# EAGLE design Mirtle_H-Bridge_shield_unoR2_DRV8833_dc90_rev1e (EAGLE 6.6.0)
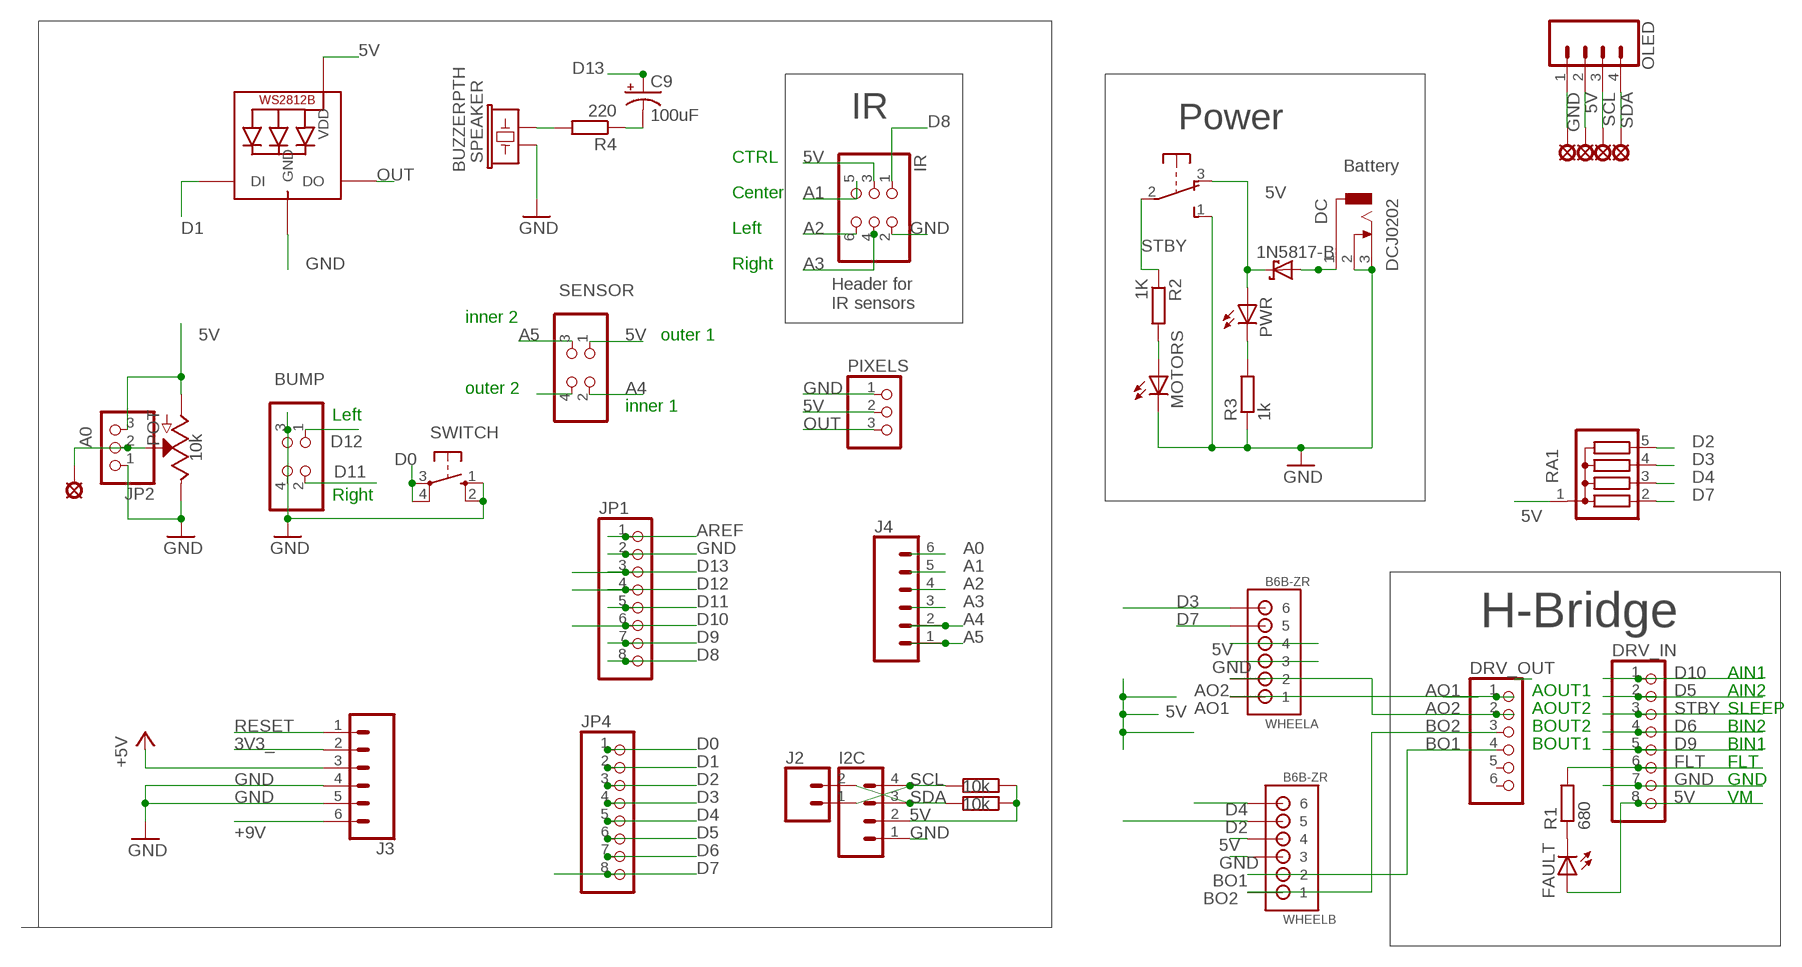
[diagram p0: schematic, sheet 1]

## Parts
BUMP  PINHD-2X2  [2X02]
C9  100uF  CPOL-USE2.5-5  [E2,5-5]
D1  1N5817-B  [DO41-7.6]
DC  DCJ0202  [DCJ0202]
DRV_IN  HEADER-1X870MIL  [1X08_ROUND_70]
DRV_OUT  PINHD-1X6CLEAN  [1X06-CLEAN]
FAULT  LED3MM  [LED3MM]
I2C  CONN_04  [1X04]
IR  PINHD-2X3  [2X03]
J2  CONN_02  [1X02]
J3  CONN_06NO_SILK_FEMALE_PTH  [1X06_NO_SILK]
J4  CONN_06NO_SILK_FEMALE_PTH  [1X06_NO_SILK]
JP1  PINHD-1X8CLEANBIG  [1X08-CLEANBIG]
JP2  PINHD-1X3CB  [1X03-CLEANBIG]
JP4  PINHD-1X8CLEANBIG  [1X08-CLEANBIG]
LED1  WS2812B5050  [WS2812B]
LSP1  LSP10  [LSP10]
LSP13  LSP10  [LSP10]
LSP14  LSP10  [LSP10]
LSP15  LSP10  [LSP10]
LSP16  LSP10  [LSP10]
MOTORS  LED3MM  [LED3MM]
OLED  CONN_04  [1X04]
PIXELS  PINHD-1X3  [1X03]
POT  10k  POTENTIOMETER-PTH-9MM-1/20W-20%  [POT-PTH-ALPS]
PWR  LED3MM  [LED3MM]
R1  680  R-EU_0204/5  [0204/5]
R2  1K  R-EU_0204/5  [0204/5]
R3  1k  R-EU_0204/5  [0204/5]
R4  220  R-EU_0204/5  [0204/5]
R5  10k  R-EU_0204/5  [0204/5]
R6  10k  R-EU_0204/5  [0204/5]
RA1  G04R  [SIL5]
SENSOR  PINHD-2X2  [2X02]
SPEAKER  BUZZERPTH  [BUZZER-12MM]
SW1  OS102011MA1Q  [OS102011MA1Q]
SWITCH  10-XX  [B3F-10XX]
WHEELA  B6B-ZR  [B6B-ZR]
WHEELB  B6B-ZR  [B6B-ZR]

## Nets
3V3_: J3.2
5V: D1.C DRV_IN.8 FAULT.A I2C.2 IR.3 J3.3 JP2.3 LED1.1-VDD(VDD) LSP14.MP OLED.2 PIXELS.2 POT.P$3(A) PWR.A R5.1 R6.1 RA1.1 SENSOR.1 SW1.3(O) WHEELA.4 WHEELB.4 ; supply symbol labelled +5V
5VIN: D1.A DC.1
+9V: J3.6
A0: J4.6 JP2.2 LSP1.MP POT.P$2(S)
A1: IR.5 J4.5
A2: IR.6 J4.4
A3: IR.4 J4.3
A4: J4.2 SENSOR.2
A5: J4.1 SENSOR.3
AO1: DRV_OUT.1 WHEELA.1
AO2: DRV_OUT.2 WHEELA.2
AREF: JP1.1
BO1: DRV_OUT.4 WHEELB.2
BO2: DRV_OUT.3 WHEELB.1
D0: JP4.1 SWITCH.3(P) SWITCH.4(P1)
D1: JP4.2 LED1.4-DIN(DI)
D2: JP4.3 RA1.5 WHEELB.5
D3: JP4.4 RA1.4 WHEELA.6
D4: JP4.5 RA1.3 WHEELB.6
D5: DRV_IN.2 JP4.6
D6: DRV_IN.4 JP4.7
D7: JP4.8 RA1.2 WHEELA.5
D8: IR.1 JP1.8
D9: DRV_IN.5 JP1.7
D10: DRV_IN.1 JP1.6
D11: BUMP.2 JP1.5
D12: BUMP.1 JP1.4
D13: C9.+ JP1.3
FLT: DRV_IN.6 R1.2
GND: BUMP.3 BUMP.4 DC.2 DC.3 DRV_IN.7 I2C.1 IR.2 J3.4 J3.5 JP1.2 JP2.1 LED1.3-GND(GND) LSP13.MP MOTORS.K(C) OLED.1 PIXELS.1 POT.P$1(E) R3.1 SENSOR.4 SPEAKER.+ SW1.1(S) SWITCH.1(S) SWITCH.2(S1) WHEELA.3 WHEELB.3
N$5: PWR.K(C) R3.2
N$7: R4.2 SPEAKER.-
N$8: C9.- R4.1
N$10: FAULT.K(C) R1.1
N$16: MOTORS.A R2.2
OUT: LED1.2-DOUT(DO) PIXELS.3
RESET: J3.1
SCL: I2C.4 J2.1 LSP15.MP OLED.3 R5.2
SDA: I2C.3 J2.2 LSP16.MP OLED.4 R6.2
STBY: DRV_IN.3 R2.1 SW1.2(P)
Unconnected: DRV_OUT.5 DRV_OUT.6 SW1.MT1(MT) SW1.MT2(MT)

## Notes on the sheet
- IR | Power
- CTRL
- Battery
- Center
- Left
- Right
- Header for
  IR sensors
- inner 2
- outer 1
- outer 2
- inner 1
- Left
- Right
- H-Bridge
- AIN1
- AOUT1 | AIN2
- AOUT2 | SLEEP
- BOUT2 | BIN2
- BOUT1 | BIN1
- FLT
- GND
- VM

## Library data of the parts
BUMP SENSOR = pinhead:PINHD-2X2: PIN HEADER
C9 = adafruit:CPOL-US: POLARIZED CAPACITOR, American symbol
D1 = diode:1N581*: 1.0A SCHOTTKY BARRIER RECTIFIER Source: http://www.diodes.com/datasheets/ds23001.pdf
DC = con-jack:DCJ0202: DC POWER JACK Source: DCJ0202.pdf; OC_FARNELL: unknown; OC_NEWARK: unknown
DRV_IN = microbuilder:HEADER-1X8: PIN HEADER
DRV_OUT = adafruit:PINHD-1X6: PIN HEADER
FAULT MOTORS PWR = led:LED: LED OSRAM: - CHIPLED LG R971, LG N971, LY N971, LG Q971, LY Q971, LO R971, LY R971 LH N974, LH R974 LS Q976, LO Q976, LY Q976 LO Q996 - Hyper CHIPLED LW Q18S LB Q993, LB Q99A, LB R99A - SideLED LS A670, LO A670, LY A670, LG A670, LP A670 LB A673, LV A673, LT A673, LW A673 LH A674 LY A675 LS A676, LA A676, LO A676, LY A676, LW A676 LS A679, LY A679, LG A679 - Hyper Micro SIDELED® LS Y876, LA Y876, LO Y876, LY Y876 LT Y87S - SmartLED LW L88C, LW L88S LB L89C, LB L89S, LG L890 LS L89K, LO L89K, LY L89K LS L896, LA L896, LO L896, LY L896 - TOPLED LS T670, LO T670, LY T670, LG T670, LP T670 LSG T670, LSP T670, LSY T670, LOP T670, LYG T670 LG T671, LOG T671, LSG T671 LB T673, LV T673, LT T673, LW T673 LH T674 LS T676, LA T676, LO T676, LY T676, LB T676, LH T676, LSB T676, LW T676 LB T67C, LV T67C, LT T67C, LS T67K, LO T67K, LY T67K, LW E67C LS E67B, LA E67B, LO E67B, LY E67B, LB E67C, LV E67C, LT E67C LW T67C LS T679, LY T679, LG T679 LS T770, LO T770, LY T770, LG T770, LP T770 LB T773, LV T773, LT T773, LW T773 LH T774 LS E675, LA E675, LY E675, LS T675 LS T776, LA T776, LO T776, LY T776, LB T776 LHGB T686 LT T68C, LB T68C - Hyper Mini TOPLED® LB M676 - Mini TOPLED Santana® LG M470 LS M47K, LO M47K, LY M47K Source: http://www.osram.convergy.de LUXEON: - LUMILED® LXK2-PW12-R00, LXK2-PW12-S00, LXK2-PW14-U00, LXK2-PW14-V00 LXK2-PM12-R00, LXK2-PM12-S00, LXK2-PM14-U00 LXK2-PE12-Q00, LXK2-PE12-R00, LXK2-PE12-S00, LXK2-PE14-T00, LXK2-PE14-U00 LXK2-PB12-K00, LXK2-PB12-L00, LXK2-PB12-M00, LXK2-PB14-N00, LXK2-PB14-P00, LXK2-PB14-Q00 LXK2-PR12-L00, LXK2-PR12-M00, LXK2-PR14-Q00, LXK2-PR14-R00 LXK2-PD12-Q00, LXK2-PD12-R00, LXK2-PD12-S00 LXK2-PH12-R00, LXK2-PH12-S00 LXK2-PL12-P00, LXK2-PL12-Q00, LXK2-PL12-R00 Source: www.luxeon.com KINGBRIGHT: KA-3528ASYC Source: www.kingbright.com
I2C OLED = SparkFun-Connectors:CONN_04: Multi connection point. Often used as Generic Header-pin footprint for 0.1 inch spaced/style header connections On any of the 0.1 inch spaced packages, you can populate with these: Break Away Headers - Straight <https://www.sparkfun.com/products/116> (PRT-00116) Break Away Male Headers - Right Angle <https://www.sparkfun.com/products/553> (PRT-00553) Female Headers <https://www.sparkfun.com/products/115> (PRT-00115) Break Away Headers - Machine Pin <https://www.sparkfun.com/products/117> (PRT-00117) Break Away Female Headers - Swiss Machine Pin <https://www.sparkfun.com/products/743> (PRT-00743) For SCREWTERMINALS and SPRING TERMINALS visit here: Screw Terimnals on SparkFun.com <https://www.sparkfun.com/search/results?term=Screw+Terminals> (5mm/3.5mm/2.54mm spacing) This device is also useful as a general connection point to wire up your design to another part of your project. Our various solder wires solder well into these plated through hole pads. Hook-Up Wire - Assortment (Stranded, 22 AWG) <https://www.sparkfun.com/products/11375> (PRT-11375) Hook-Up Wire - Assortment (Solid Core, 22 AWG) <https://www.sparkfun.com/products/11367> (PRT-11367) View the entire wire category on our website here <https://www.sparkfun.com/categories/141> Special notes: Molex polarized connector foot print use with SKU : PRT-08231 with associated crimp pins and housings. 1MM SMD Version SKU: PRT-10208; PROD_ID: CONN-09696
IR = pinhead:PINHD-2X3: PIN HEADER
J2 = SparkFun-Connectors:CONN_02: Multi connection point. Often used as Generic Header-pin footprint for 0.1 inch spaced/style header connections On any of the 0.1 inch spaced packages, you can populate with these: Break Away Headers - Straight <https://www.sparkfun.com/products/116> (PRT-00116) Break Away Male Headers - Right Angle <https://www.sparkfun.com/products/553> (PRT-00553) Female Headers <https://www.sparkfun.com/products/115> (PRT-00115) Break Away Headers - Machine Pin <https://www.sparkfun.com/products/117> (PRT-00117) Break Away Female Headers - Swiss Machine Pin <https://www.sparkfun.com/products/743> (PRT-00743) For SCREWTERMINALS and SPRING TERMINALS visit here: Screw Terimnals on SparkFun.com <https://www.sparkfun.com/search/results?term=Screw+Terminals> (5mm/3.5mm/2.54mm spacing) This device is also useful as a general connection point to wire up your design to another part of your project. Our various solder wires solder well into these plated through hole pads. Hook-Up Wire - Assortment (Stranded, 22 AWG) <https://www.sparkfun.com/products/11375> (PRT-11375) Hook-Up Wire - Assortment (Solid Core, 22 AWG) <https://www.sparkfun.com/products/11367> (PRT-11367) View the entire wire category on our website here <https://www.sparkfun.com/categories/141> Special notes: Molex polarized connector foot print use with: PRT-08233 with associated crimp pins and housings. 2.54_SCREWTERM for use with PRT-10571. 3.5mm Screw Terminal footprints for PRT-08084 5mm Screw Terminal footprints for use with PRT-08432
J3 J4 = SparkFun-Connectors:CONN_06: Multi connection point. Often used as Generic Header-pin footprint for 0.1 inch spaced/style header connections On any of the 0.1 inch spaced packages, you can populate with these: Break Away Headers - Straight <https://www.sparkfun.com/products/116> (PRT-00116) Break Away Male Headers - Right Angle <https://www.sparkfun.com/products/553> (PRT-00553) Female Headers <https://www.sparkfun.com/products/115> (PRT-00115) Break Away Headers - Machine Pin <https://www.sparkfun.com/products/117> (PRT-00117) Break Away Female Headers - Swiss Machine Pin <https://www.sparkfun.com/products/743> (PRT-00743) Arduino Stackable Header - 6 Pin <https://www.sparkfun.com/products/9280> (PRT-09280) For SCREWTERMINALS and SPRING TERMINALS visit here: Screw Terimnals on SparkFun.com <https://www.sparkfun.com/search/results?term=Screw+Terminals> (5mm/3.5mm/2.54mm spacing) This device is also useful as a general connection point to wire up your design to another part of your project. Our various solder wires solder well into these plated through hole pads. Hook-Up Wire - Assortment (Stranded, 22 AWG) <https://www.sparkfun.com/products/11375> (PRT-11375) Hook-Up Wire - Assortment (Solid Core, 22 AWG) <https://www.sparkfun.com/products/11367> (PRT-11367) View the entire wire category on our website here <https://www.sparkfun.com/categories/141>; PROD_ID: CONN-08437
JP1 JP4 = adafruit:PINHD-1X8: PIN HEADER
JP2 = adafruit_mem:PINHD-1X3: PIN HEADER
LED1 = adafruitx:WS2812B
LSP1 LSP13-LSP16 = solpad:LSP10: SOLDER PAD drill 1.0 mm, distributor Buerklin, 12H555
PIXELS = adafruit:PINHD-1X3: PIN HEADER
POT = SparkFun-Resistors:POTENTIOMETER: Potentiometer (Pot) Three-terminal potentiometers, with an adjustable wiper and two adjustable resistors. A pot can be used to create a configurable voltage divider, or as a variable resistor. Variants ALPS_POT and ALPS_POT_KIT - PTH, breadboard compatible, 9mm square pots Rotary Potentiometer - Linear (10k ohm) <https://www.sparkfun.com/products/9288> (COM-09288) The KIT variant exposes copper on only one side of the PTH pad, so the part can only be assembled on one side of the PCB. Useful for beginner soldering kits.; PROD_ID: RES-09177; SF_SKU: COM-09288
R1-R6 = resistor:R-EU_: RESISTOR, European symbol
RA1 = resistor-sil:G04R: SIL RESISTOR; OC_FARNELL: unknown; OC_NEWARK: unknown
SPEAKER = SparkFun-Electromechanical:BUZZER: Buzzer 12mm Spark Fun Electronics SKU : Comp-Buzzer
SW1 = adafruit_mem:OS102011MA1Q: OS10201MA1Q through-hole right angle switch http://www.ladyada.net/library/eagle
SWITCH = switch-omron:10-XX: OMRON SWITCH; MPN: B3F-1000; OC_FARNELL: 176432; OC_NEWARK: 36M3542
WHEELA WHEELB = jst:B6B-ZR: JST-ZH Connector 6 pol, 1.5mm pitch Package: B6B-ZR Source: http://www.jst-mfg.com/product/pdf/eng/eZH.pdf

## Board
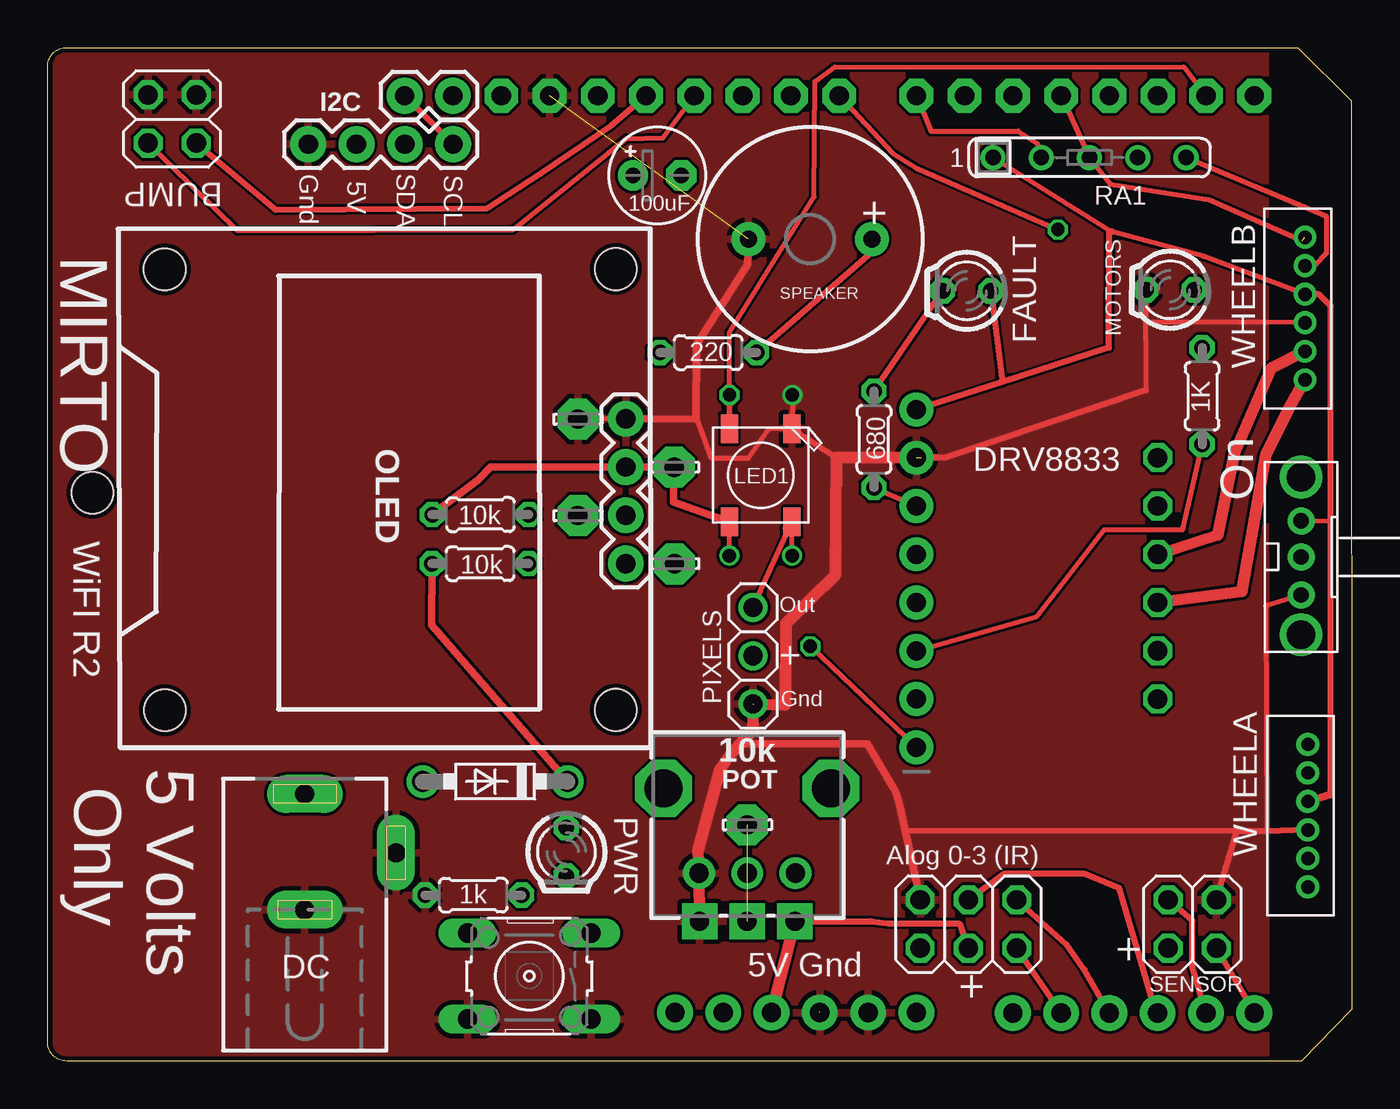
[diagram p1: board, top side]
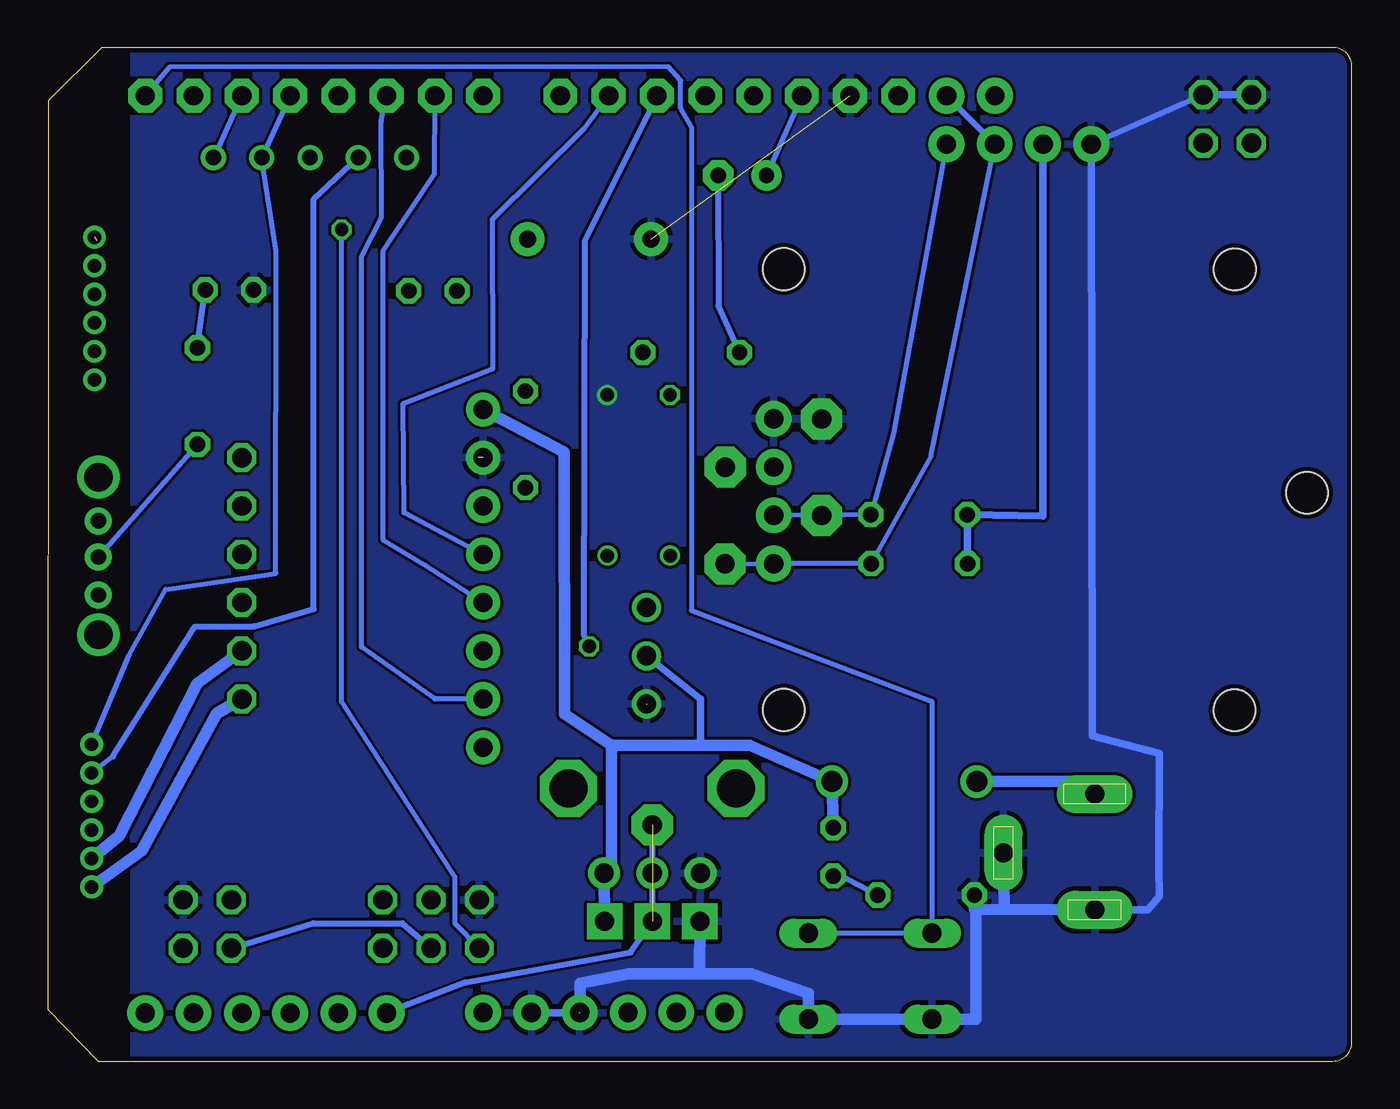
[diagram p2: board, bottom side, seen from below]

Size 68.64 x 53.34 mm. Coordinates in mm from the lower left corner, seen from the top.
Outline: 65.79,53.34 68.61,50.55 68.64,2.73 65.98,0 1,0 arc-90 0,1 0,52.34 arc-90 1,53.34 65.79,53.34
Copper layers (1*16): Top 0.035mm / dielectric 1.5mm / Bottom 0.035mm
Design rules "SeeedStudio_2layer_DRU_no_angle_20140221": minimum track width 6mil, minimum drill 12mil, track to track 6mil, track to pad 6mil, pad to pad 6mil, via to via 6mil, smd to smd 0mil, copper to edge 10mil, drill to drill 10mil, minimum pad ring 10mil, minimum via ring 6mil, stop-mask expansion 2mil, vias tented up to drill 100mil, thermal gap 10mil
Holes 2.2 mm at 6.17,41.67 6.18,18.47 29.9,41.68 29.9,18.48 2.37,29.9

### Footprints (pad centres in the part's own frame; a part is rotated, then mirrored left to right if it is on the bottom)
2X02 = drill 1.016 octagon: 1 -1.27,-1.27; 2 -1.27,1.27; 3 1.27,-1.27; 4 1.27,1.27
E2,5-5 = drill 0.813 pad 1.6: + -1.27,0 | drill 0.813 pad 1.6 octagon: - 1.27,0
DO41-7.6 = drill 1.1 pad 1.7: A 3.81,0; C -3.81,0
DCJ0202 = drill 1 pad 2 long: 1 0,3.1; 2 4.8,0; 3 0,-3
1X08_ROUND_70 = drill 1 pad 1.778: 1 -8.89,0; 2 -6.35,0; 3 -3.81,0; 4 -1.27,0; 5 1.27,0; 6 3.81,0; 7 6.35,0; 8 8.89,0
1X06-CLEAN = drill 1.016 octagon: 1 -6.35,0; 2 -3.81,0; 3 -1.27,0; 4 1.27,0; 5 3.81,0; 6 6.35,0
LED3MM = drill 0.813 octagon: A -1.27,0; K 1.27,0
1X04 = drill 1.016 pad 1.88: 1 0,0; 2 2.54,0; 3 5.08,0; 4 7.62,0
2X03 = drill 1.016 octagon: 1 -2.54,-1.27; 2 -2.54,1.27; 3 0,-1.27; 4 0,1.27; 5 2.54,-1.27; 6 2.54,1.27
1X02 = drill 1.016 pad 1.88: 1 0,0; 2 2.54,0
1X06_NO_SILK = drill 1.016 pad 1.88: 1 0,0; 2 2.54,0; 3 5.08,0; 4 7.62,0; 5 10.16,0; 6 12.7,0
1X08-CLEANBIG = drill 1.016 pad 1.778 octagon: 1 -8.89,0; 2 -6.35,0; 3 -3.81,0; 4 -1.27,0; 5 1.27,0; 6 3.81,0; 7 6.35,0; 8 8.89,0
1X03-CLEANBIG = drill 1.016 pad 1.676: 1 -2.54,0; 2 0,0; 3 2.54,0
WS2812B = smd 1.5 x 0.9: 1-VDD 2.45,-1.65; 2-DOUT 2.45,1.65; 3-GND -2.45,1.65; 4-DIN -2.45,-1.65
LSP10 = drill 1.016 pad 2.159 octagon: MP 0,0
1X03 = drill 1.016: 1 -2.54,0; 2 0,0; 3 2.54,0
POT-PTH-ALPS = drill 1 pad 1.88 square: P$1 7,-2.5; P$2 7,0; P$3 7,2.5 | drill 2 octagon: P$4 0,-4.4; P$5 0,4.4
0204/5 = drill 0.813 octagon: 1 -2.54,0; 2 2.54,0
SIL5 = drill 0.813: 1 -5.08,0; 2 -2.54,0; 3 0,0; 4 2.54,0; 5 5.08,0
BUZZER-12MM = drill 0.9 pad 1.778: + 3.25,0; - -3.25,0
OS102011MA1Q = drill 0.8 pad 1.422: 1 -2,0; 2 0,0; 3 1.9,0 | drill 1.5 pad 2.184: MT1 -4.1,0; MT2 4.2,0
B3F-10XX = drill 1.016 long: 1 -3.251,2.261; 2 3.251,2.261; 3 -3.251,-2.261; 4 3.251,-2.261
B6B-ZR = drill 0.7: 1 9,-1.3; 2 7.5,-1.3; 3 6,-1.3; 4 4.5,-1.3; 5 3,-1.3; 6 1.5,-1.3

### Placement (x,y rotation side)
BUMP  6.56,49.58 90 top
C9  32.08,46.61 0 top
D1  23.55,14.71 180 top
DC  13.54,10.96 0 top
DRV_IN  45.72,25.4 90 top
DRV_OUT  58.42,25.4 90 top
FAULT  48.37,40.53 180 top
I2C  13.72,48.25 0 top
IR  48.46,7.21 0 top
J2  18.79,50.8 0 top
J3  33.02,2.55 0 top
J4  63.5,2.53 180 top
JP1  32.77,50.8 0 top
JP2  36.82,9.89 0 top
JP4  54.61,50.8 180 top
LED1  37.53,30.83 270 top
LSP1  36.82,12.43 0 top
LSP13  27.91,33.79 0 top
LSP14  32.98,31.25 0 top
LSP15  27.91,28.71 0 top
LSP16  32.99,26.17 0 top
MOTORS  59.08,40.58 180 top
OLED  30.43,33.8 270 top
PIXELS  37.12,21.33 90 top
POT  36.82,14.35 270 top
PWR  27.3,11.01 270 top
R1  43.49,32.72 270 top
R2  60.76,34.99 90 top
R3  22.41,8.73 0 top
R4  34.77,37.29 0 top
R5  22.78,28.76 0 top
R6  22.77,26.18 0 top
RA1  54.83,47.55 0 top
SENSOR  60.24,7.21 0 top
SPEAKER  40.13,43.26 180 top
SW1  65.97,26.53 90 top
SWITCH  25.35,4.47 180 top
WHEELA  67.63,18.16 270 top
WHEELB  67.47,44.85 270 top

### Tracks (layer width: path | path; a pad name or v marks a point on that pad's centre or on a via)
5V  (via drill 0.7)
  Top 0.254: WHEELB.4 60.82,42.35 56.01,43.66 56.07,43.6 RA1.1 | SW1.3 67.52,28.44 | v35.88,26.6 LED1.1-VDD
  Top 0.305: 67.53,14.03 67.52,28.44 67.53,39.72 66.89,40.36 WHEELB.4 | 56.01,43.66 55.88,43.66 55.86,37.54 50.26,35.74 | 50.26,35.74 DRV_IN.8 | POT.P$3 43.33,7.35 43.33,7.36 44.23,7.24 47.98,7.24 IR.3 | FAULT.A 50.26,35.74
  Top 0.406: 67.53,14.03 WHEELA.4 | R5.1 22.68,30.61 23.32,31.26 OLED.2 LSP14.MP 32.94,29.41 LED1.1-VDD | D1.C 20.22,22.95 R6.1
  Top 0.61: J3.3 POT.P$3
  Bottom 0.305: SENSOR.1 54.66,7.25 49.98,7.25 IR.3
  Bottom 0.406: I2C.2 16.25,28.68 R5.1 R6.1 | PIXELS.2 34.29,19.05 34.29,16.6
  Bottom 0.61: 38.97,16.6 38.98,10.03 JP2.3 POT.P$3 | PWR.A D1.C 31.68,16.6 34.29,16.6 38.97,16.6 | 38.97,16.6 41.43,18.26 41.45,32.04 DRV_IN.8
5VIN
  Bottom 0.61: DC.1 13.61,14.03 13.72,14.69 13.72,14.72 D1.A
A0  (1 unrouted)
  Bottom 0.305: J4.6 46.62,4.14 37.96,5.72 POT.P$2 LSP1.MP
A1
  Top 0.305: J4.5 IR.5
A2
  Top 0.305: J4.4 54.57,4.81 53.64,6.12 IR.6
A3
  Top 0.305: J4.3 58.16,3.13 56.4,9.1 54.57,9.85 50.32,9.84 IR.4
A4
  Top 0.305: J4.2 60.23,4.97 60.25,7.4 SENSOR.2
A5
  Top 0.305: SENSOR.3 J4.1
AO1
  Bottom 0.61: WHEELA.1 63.68,11.07 59.74,18.3 DRV_OUT.1
AO2
  Bottom 0.61: WHEELA.2 64.86,11.84 60.77,19.87 DRV_OUT.2
BO1
  Top 0.61: WHEELB.2 64.39,36.48 62.45,31.98 61.57,27.69 DRV_OUT.4
BO2
  Top 0.61: WHEELB.1 65.36,34.44 64.12,31.89 62.83,24.71 DRV_OUT.3
D0
  Bottom 0.254: JP4.1 62.24,52.29 35.97,52.32 35.32,51.62 35.33,50.15 34.75,49.14 34.76,23.72 22.11,18.93 SWITCH.4 SWITCH.3
D1  (via drill 0.7)
  Top 0.254: JP4.2 59.79,52.32 41.41,52.31 40.38,51.55 40.34,45.49 35.89,38.37 LED1.4-DIN v35.89,35.06
D2
  Top 0.254: WHEELB.5 66.71,41.88 67.31,42.51 67.31,44.45 RA1.5
  Bottom 0.254: JP4.3 RA1.5
D3
  Bottom 0.254: WHEELA.6 64.34,21.36 62.43,24.82 56.63,25.67 56.62,42.64 RA1.4 JP4.4
D4  (1 unrouted)
  Top 0.254: 66.04,43.18 61.13,45.33 55.92,46.14 RA1.3 JP4.5
D5
  Bottom 0.254: DRV_IN.2 48.27,19.05 48.27,19.09 52.12,21.79 52.11,42.37 51.07,44.4 51.08,49.46 JP4.6
D6
  Bottom 0.254: JP4.7 48.28,46.7 50.98,42.66 50.98,27.41 48.75,26.09 DRV_IN.4
D7
  Top 0.254: JP4.8 46.48,48.94 51.08,48.94 51.78,48.48 52.09,48.27 RA1.2
  Bottom 0.254: 65.2,16.03 WHEELA.5
  Bottom 0.305: 65.2,16.03 61.01,22.69 60.88,22.86 60.11,22.86 59.24,22.87 57.77,22.87 54.63,23.79 54.63,45.36 RA1.2
D8  (via drill 0.7)
  Top 0.254: JP1.8 44.49,47.76 45.72,46.98 v53.17,43.76
  Bottom 0.254: IR.1 47.22,7.26 47.22,9.7 53.17,18.91 v53.17,43.76
D9
  Bottom 0.254: JP1.7 40.4,49.06 45.23,44.3 45.2,36.44 49.92,34.61 49.89,28.86 DRV_IN.5
D10  (via drill 0.7)
  Top 0.254: DRV_IN.1 v40.14,21.83
  Bottom 0.305: JP1.6 40.38,43.15 40.43,22.47 v40.14,21.83
D11
  Top 0.254: BUMP.2 10.01,43.71 24.5,43.76 30.43,48.54 32.38,48.59 JP1.5
D12
  Top 0.305: BUMP.1 12,44.8 23.12,44.88 25.93,46.7 29.68,49.25 JP1.4
D13
  Bottom 0.254: JP1.3 C9.+
FLT
  Top 0.254: R1.2 DRV_IN.6
GND  (via drill 0.7)  (4 unrouted)
  Top 0.254: WHEELB.3 57.82,38.88 MOTORS.K 57.81,35.31 | SW1.1 64.1,23.95 64.15,12.1 | LSP13.MP OLED.1 34.19,33.81 34.94,31.71 36.87,31.72 37.93,33.27 LED1.3-GND v39.19,35.06 | 36.36,16.69 36.01,16.24
  Top 0.305: 57.81,35.31 47.27,31.75 45.98,31.75 | WHEELA.3 64.15,12.1 62.59,12.1 | 62.59,12.1 45.13,12.11 44.81,13.64 | SENSOR.4 62.59,12.1 | LED1.3-GND 41.51,31.76
  Top 0.406: OLED.1 34.12,33.79 34.15,37.71 36.83,41.91 SPEAKER.+ | 44.79,31.75 44.48,31.77 | 36.36,16.69 43.14,16.69 44.61,14.2 44.81,13.64 IR.2
  Top 0.61: 45.98,31.75 44.48,31.77 | POT.P$1 JP2.1 34.24,11.1 35.38,15.34 | 35.38,15.34 35.42,15.39 | 44.79,31.75 41.51,31.76 41.47,25.58 38.85,23.04 38.83,18.75 37.12,18.75 37.12,17.4 36.01,16.24 35.38,15.34
  Bottom 0.305: BUMP.3 I2C.1 | 18.3,7.99 19.55,7.98
  Bottom 0.406: J3.4 J3.5 | BUMP.3 BUMP.4 | I2C.1 13.66,17.12 10.13,16.18 10.17,10.22 10.13,8.68 10.74,7.95 12.71,7.95 DC.3
  Bottom 0.61: 34.33,4.58 34.18,4.59 31.59,4.58 28.61,3.56 SWITCH.1 SWITCH.2 19.8,2.21 19.78,7.99 19.78,8 R3.1 19.88,7.98 19.55,7.98 14.37,7.96 DC.3 | 34.33,4.58 38.08,4.58 40.63,4.1 40.61,2.57 | POT.P$1 34.33,4.58 | DC.2 18.3,7.99
  pour Top: -0.02,53.18 0,0 64.11,0.11 64.09,53.23
  pour Bottom: -0.01,53.19 0,0 64.11,0.12 64.1,53.21
N$5
  Bottom 0.305: R3.2 27,9.79 PWR.K
N$7
  Top 0.305: R4.2 43.41,42.59 SPEAKER.-
N$8
  Bottom 0.305: C9.- 33.34,39.74 R4.1
N$10
  Top 0.305: R1.1 FAULT.K
N$16
  Bottom 0.305: R2.2 MOTORS.A
OUT  (via drill 0.7)
  Top 0.254: PIXELS.3 LED1.2-DOUT | LED1.2-DOUT 38.78,28.04 | v39.18,26.6 LED1.2-DOUT
SCL
  Top 0.305: J2.1 I2C.4
  Bottom 0.254: I2C.4 24.13,33.02 R5.2 | R5.2 OLED.3 | R5.2 LSP15.MP
SDA
  Bottom 0.254: I2C.3 22.15,31.83 R6.2 OLED.4 LSP16.MP
  Bottom 0.305: I2C.3 J2.2
STBY
  Top 0.254: DRV_IN.3 52.06,23.4 55.61,27.97 59.73,27.97 R2.1
  Bottom 0.254: R2.1 SW1.2

### Text on the board
tNames: Gnd | SDA | SCL | 5V | + | MIRTO | DRV8833 | On | WiFI R2 | Out | + | Gnd | 5 Volts / Only | Alog 0-3 (IR) | + | 5V Gnd | +